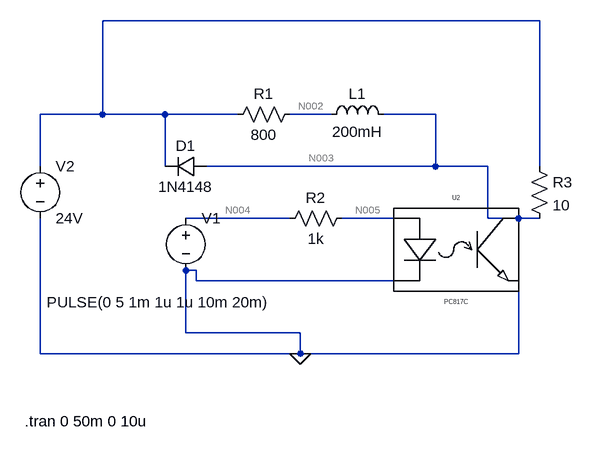
[diagram p0: schematic Bobibn ile seri R-L devresi_opto_v2.asc]
Bobibn ile seri R-L devresi_opto_v2.asc, the LTspice schematic file:
Version 4.1
SHEET 1 880 680
WIRE 512 -16 -160 -16
WIRE -160 128 -160 -16
WIRE -160 128 -256 128
WIRE -64 128 -160 128
WIRE 48 128 -64 128
WIRE 192 128 128 128
WIRE 352 128 272 128
WIRE -256 208 -256 128
WIRE -64 208 -64 128
WIRE 352 208 352 128
WIRE 352 208 0 208
WIRE 432 208 352 208
WIRE 512 208 512 -16
WIRE 128 288 -32 288
WIRE 288 288 208 288
WIRE 432 288 432 208
WIRE 480 288 432 288
WIRE 512 288 480 288
WIRE -16 368 -32 368
WIRE -16 384 -16 368
WIRE 288 384 -16 384
WIRE -32 464 -32 368
WIRE 144 464 -32 464
WIRE -256 496 -256 288
WIRE 144 496 144 464
WIRE 144 496 -256 496
WIRE 480 496 480 384
WIRE 480 496 144 496
FLAG 144 496 0
SYMBOL res 144 112 R90
WINDOW 0 0 56 VBottom 2
WINDOW 3 32 56 VTop 2
SYMATTR InstName R1
SYMATTR Value 800
SYMBOL ind 176 144 R270
WINDOW 0 32 56 VTop 2
WINDOW 3 5 56 VBottom 2
SYMATTR InstName L1
SYMATTR Value 200mH
SYMATTR SpiceLine Rser=1m
SYMBOL res 224 272 R90
WINDOW 0 0 56 VBottom 2
WINDOW 3 32 56 VTop 2
SYMATTR InstName R2
SYMATTR Value 1k
SYMBOL voltage -32 272 R0
WINDOW 3 -214 145 Left 2
WINDOW 123 0 0 Left 0
WINDOW 39 0 0 Left 0
SYMATTR Value PULSE(0 5 1m 1u 1u 10m 20m)
SYMATTR InstName V1
SYMBOL voltage -256 192 R0
WINDOW 123 0 0 Left 0
WINDOW 39 0 0 Left 0
SYMATTR InstName V2
SYMATTR Value 24V
SYMBOL diode 0 192 R90
WINDOW 0 0 32 VBottom 2
WINDOW 3 32 32 VTop 2
SYMATTR InstName D1
SYMATTR Value 1N4148
SYMBOL res 496 192 R0
SYMATTR InstName R3
SYMATTR Value 10
SYMBOL PC817C 384 336 R0
SYMATTR InstName U2
TEXT -280 600 Left 2 !.tran 0 50m 0 10u

The netlist it stands for:
* Bobibn ile seri R-L devresi_opto_v2.asc
R1 N002 N001 800
L1 N002 N003 200mH Rser=1m
R2 N005 N004 1k
V1 N004 0 PULSE(0 5 1m 1u 1u 10m 20m)
V2 N001 0 24V
D1 N003 N001 1N4148
R3 N001 N003 10
X§U2 N005 0 N003 0 PC817 Igain=2.3m  ; pins A K C E
.model D D
.lib standard.dio
.tran 0 50m 0 10u
.lib PC817.sub
.backanno
.end

* Results of the author's LTspice run, read from the files saved beside the schematic
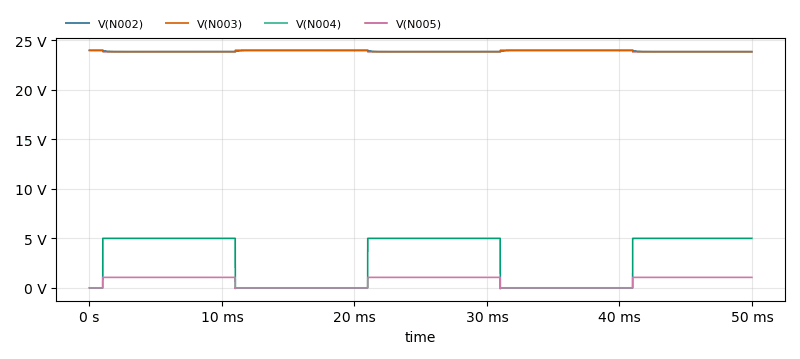
[diagram p1: Transient Analysis of Bobibn ile seri R-L devresi_opto_v2.asc, plotted from the saved traces]
* Transient Analysis, 1 run:
*   V(N002): min 23.87 V, max 24 V, average 23.92 V, rms 23.92 V, last 23.87 V
*   V(N003): min 23.87 V, max 24 V, average 23.92 V, rms 23.92 V, last 23.87 V
*   V(N004): min 0 V, max 5 V, average 2.9 V, rms 3.808 V, last 5 V
*   V(N005): min -98.33 mV, max 1.056 V, average 612.4 mV, rms 804.1 mV, last 1.056 V